# EAGLE design LED_XLampXBD (EAGLE 7.5.0)
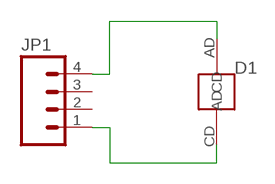
[diagram p0: schematic, sheet 1]

## Parts
D1  XLAMP_XBD  [XLAMP_XBD]
JP1  M04PTH  [1X04]

## Nets
N$1: D1.CD JP1.1
N$2: D1.AD JP1.4
Unconnected: JP1.2 JP1.3

## Library data of the parts
D1 = freddyLibr:XLAMP_XBD
JP1 = SparkFun-Connectors:M04: Header 4 Standard 4-pin 0.1" header. Use with straight break away headers (SKU : PRT-00116), right angle break away headers (PRT-00553), swiss pins (PRT-00743), machine pins (PRT-00117), and female headers (PRT-00115). Molex polarized connector foot print use with SKU : PRT-08231 with associated crimp pins and housings. 1MM SMD Version SKU: PRT-10208

## Board
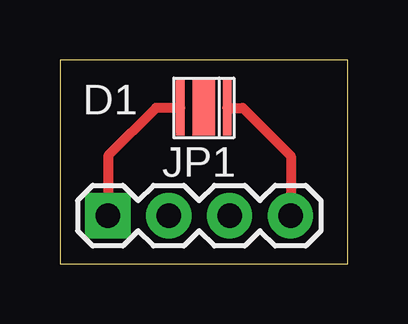
[diagram p1: board, top side]

Size 12 x 8.5 mm. Coordinates in mm from the lower left corner, seen from the top.
Outline: 0,0 12,0 12,8.5 0,8.5 0,0
Copper layers (1*16): Top 0.0356mm / dielectric 1.5011mm / Bottom 0.0356mm
Design rules "LaenPCBOrder": minimum track width 6mil, minimum drill 13mil, track to track 6mil, track to pad 6mil, pad to pad 6mil, via to via 6mil, smd to smd 6mil, copper to edge 15mil, drill to drill 6mil, minimum pad ring 7mil, minimum via ring 7mil, stop-mask expansion 3mil, vias tented up to drill 0mil, thermal gap 10mil

### Footprints (pad centres in the part's own frame; a part is rotated, then mirrored left to right if it is on the bottom)
XLAMP_XBD = smd 0.34 x 2.3: AD -0.98,0; CD 0.98,0 | smd 0.92 x 2.3: NC 0,0
1X04 = drill 1.016 pad 1.88 square: 1 0,0 | drill 1.016 pad 1.88: 2 2.54,0; 3 5.08,0; 4 7.62,0

### Placement (x,y rotation side)
D1  6,6.5 180 top
JP1  2,2 0 top

### Tracks (layer width: path | path; a pad name or v marks a point on that pad's centre or on a via)
N$1
  Top 0.406: D1.CD 4.01,6.5 2.02,4.51 2.02,2.02 JP1.1
N$2
  Top 0.406: D1.AD 7.63,6.5 9.63,4.5 JP1.4